# Altium schematic sheet Banana2USB.SchDoc
size A3; SheetNumber: 1; SheetTotal: 1
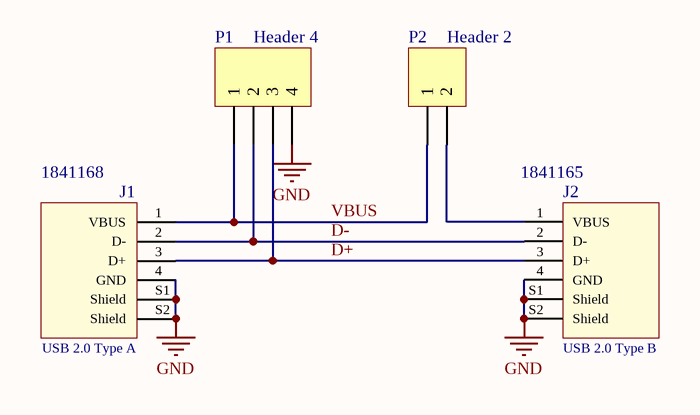
[diagram p0: Banana2USB.SchDoc]

## Parts
J1  USB 2.0 Type A  Supplier Part Number 1: 1841168  [614004135023]
J2  USB 2.0 Type B  Supplier Part Number 1: 1841165  [61400413321]
P1  Header 4  [HDR1X4]
P2  Header 2  [HDR1X2]

## Nets
GND: J1.4(GND) J1.S1(Shield) J1.S2(Shield) J2.4(GND) J2.S1(Shield) J2.S2(Shield) P1.4
D+: J1.3(D+) J2.3(D+) P1.3
D-: J1.2(D-) J2.2(D-) P1.2
VBUS: J1.1(VBUS) P1.1 P2.1
NetJ2_1: J2.1(VBUS) P2.2

## Library data of the parts
J1 = 614004135023: USB 2.0 Type A Vertical THT WR-COM; Rated Current: 1.5 A; Gender: Female; ComponentLink1Description: Manufacturer; ComponentLink1URL: http://www.we-online.de; ComponentLink2Description: Datasheet; ComponentLink2URL: http://katalog.we-online.de/em/datasheet/614004135023.pdf; Part Number: 614004135023; Published Date: May 2018; Publisher: Wurth Elektronik; Orientation: Vertical; Interface Type: USB 2.0 Type A; Operating Temperature: -40 to 105 degC; Mounting Technology: THT; Packaging: Tray; Supplier 1: Farnell
J2 = 61400413321: USB 2.0 Type B Vertical THT WR-COM; Rated Current: 1.5 A; Gender: Female; ComponentLink1Description: Manufacturer; ComponentLink1URL: http://www.we-online.de; ComponentLink2Description: Datasheet; ComponentLink2URL: http://katalog.we-online.de/em/datasheet/61400413321.pdf; Part Number: 61400413321; Published Date: May 2018; Publisher: Wurth Elektronik; Orientation: Vertical; Interface Type: USB 2.0 Type B; Operating Temperature: -40 to 105 degC; Mounting Technology: THT; Packaging: Tray; Supplier 1: Farnell
P1 = Header 4: Header, 4-Pin; LatestRevisionDate: 17-Jul-2002; LatestRevisionNote: Re-released for DXP Platform.; Publisher: Altium Limited
P2 = Header 2: Header, 2-Pin; LatestRevisionDate: 17-Jul-2002; LatestRevisionNote: Re-released for DXP Platform.; Publisher: Altium Limited